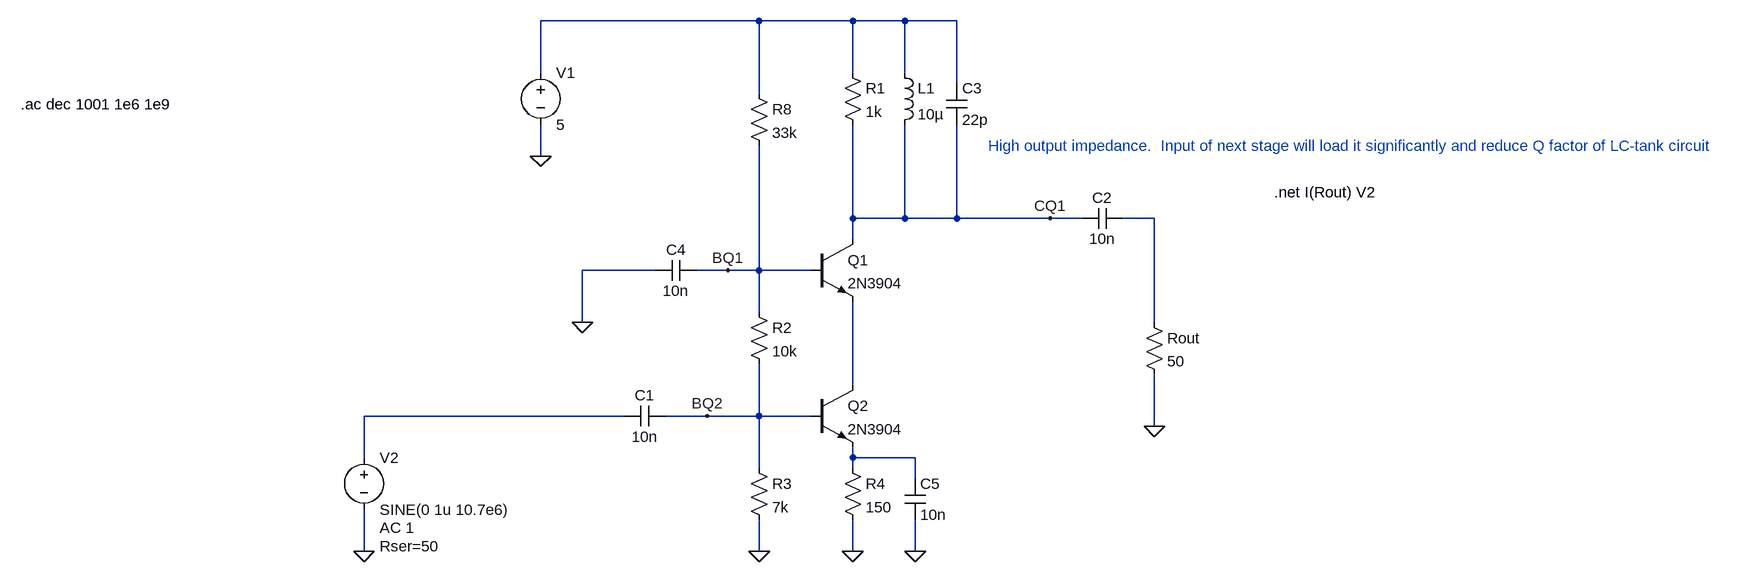
[diagram p0: schematic IF1.asc]
IF1.asc, the LTspice schematic file:
Version 4
SHEET 1 1624 680
WIRE 32 -208 -304 -208
WIRE 176 -208 32 -208
WIRE 256 -208 176 -208
WIRE 336 -208 256 -208
WIRE -304 -128 -304 -208
WIRE 176 -128 176 -208
WIRE 256 -128 256 -208
WIRE 336 -112 336 -208
WIRE 32 -96 32 -208
WIRE -304 0 -304 -48
WIRE 176 96 176 -48
WIRE 256 96 256 -48
WIRE 256 96 176 96
WIRE 336 96 336 -48
WIRE 336 96 256 96
WIRE 480 96 336 96
WIRE 528 96 480 96
WIRE 640 96 592 96
WIRE 176 128 176 96
WIRE -128 176 -240 176
WIRE -16 176 -64 176
WIRE 32 176 32 -16
WIRE 32 176 -16 176
WIRE 112 176 32 176
WIRE 32 240 32 176
WIRE -240 256 -240 176
WIRE 640 256 640 96
WIRE 176 352 176 224
WIRE -176 400 -576 400
WIRE -48 400 -112 400
WIRE 32 400 32 320
WIRE 32 400 -48 400
WIRE 112 400 32 400
WIRE 640 416 640 336
WIRE -576 464 -576 400
WIRE 176 464 176 448
WIRE 272 464 176 464
WIRE 32 480 32 400
WIRE 176 480 176 464
WIRE 272 496 272 464
WIRE -576 608 -576 544
WIRE 32 608 32 560
WIRE 176 608 176 560
WIRE 272 608 272 560
FLAG -304 0 0
FLAG 32 608 0
FLAG 176 608 0
FLAG -576 608 0
FLAG -240 256 0
FLAG -48 400 BQ2
FLAG 480 96 CQ1
FLAG -16 176 BQ1
FLAG 640 416 0
FLAG 272 608 0
SYMBOL npn 112 128 R0
SYMATTR InstName Q1
SYMATTR Value 2N3904
SYMBOL npn 112 352 R0
SYMATTR InstName Q2
SYMATTR Value 2N3904
SYMBOL res 160 -144 R0
SYMATTR InstName R1
SYMATTR Value 1k
SYMBOL res 16 224 R0
SYMATTR InstName R2
SYMATTR Value 10k
SYMBOL res 16 464 R0
SYMATTR InstName R3
SYMATTR Value 7k
SYMBOL res 160 464 R0
SYMATTR InstName R4
SYMATTR Value 150
SYMBOL cap -112 384 R90
WINDOW 0 0 32 VBottom 2
WINDOW 3 32 32 VTop 2
SYMATTR InstName C1
SYMATTR Value 10n
SYMBOL voltage -304 -144 R0
WINDOW 123 0 0 Left 0
WINDOW 39 0 0 Left 0
SYMATTR InstName V1
SYMATTR Value 5
SYMBOL voltage -576 448 R0
WINDOW 123 24 124 Left 2
WINDOW 39 24 152 Left 2
SYMATTR Value2 AC 1
SYMATTR SpiceLine Rser=50
SYMATTR InstName V2
SYMATTR Value SINE(0 1u 10.7e6)
SYMBOL res 16 -112 R0
SYMATTR InstName R8
SYMATTR Value 33k
SYMBOL cap -64 160 R90
WINDOW 0 0 32 VBottom 2
WINDOW 3 32 32 VTop 2
SYMATTR InstName C4
SYMATTR Value 10n
SYMBOL res 624 240 R0
SYMATTR InstName Rout
SYMATTR Value 50
SYMBOL cap 592 80 R90
WINDOW 0 0 32 VBottom 2
WINDOW 3 32 32 VTop 2
SYMATTR InstName C2
SYMATTR Value 10n
SYMBOL ind 240 -144 R0
SYMATTR InstName L1
SYMATTR Value 10µ
SYMBOL cap 320 -112 R0
SYMATTR InstName C3
SYMATTR Value 22p
SYMBOL cap 256 496 R0
SYMATTR InstName C5
SYMATTR Value 10n
TEXT 824 56 Left 2 !.net I(Rout) V2
TEXT -1104 -80 Left 2 !.ac dec 1001 1e6 1e9
TEXT 384 -16 Left 2 ;High output impedance.  Input of next stage will load it significantly and reduce Q factor of LC-tank circuit

The netlist it stands for:
* IF1.asc
Q1 CQ1 BQ1 N003 0 2N3904
Q2 N003 BQ2 N005 0 2N3904
R1 N001 CQ1 1k
R2 BQ1 BQ2 10k
R3 BQ2 0 7k
R4 N005 0 150
C1 BQ2 N004 10n
V1 N001 0 5
V2 N004 0 SINE(0 1u 10.7e6) AC 1 Rser=50
R8 N001 BQ1 33k
C4 BQ1 0 10n
Rout N002 0 50
C2 N002 CQ1 10n
L1 N001 CQ1 10µ
C3 N001 CQ1 22p
C5 N005 0 10n
.model NPN NPN
.model PNP PNP
.lib standard.bjt
.net I(Rout) V2
.ac dec 1001 1e6 1e9
* High output impedance.  Input of next stage will load it significantly and reduce Q factor of LC-tank circuit
.backanno
.end